# Altium schematic sheet main.SchDoc
size A4; SheetNumber: 1; SheetTotal: 14
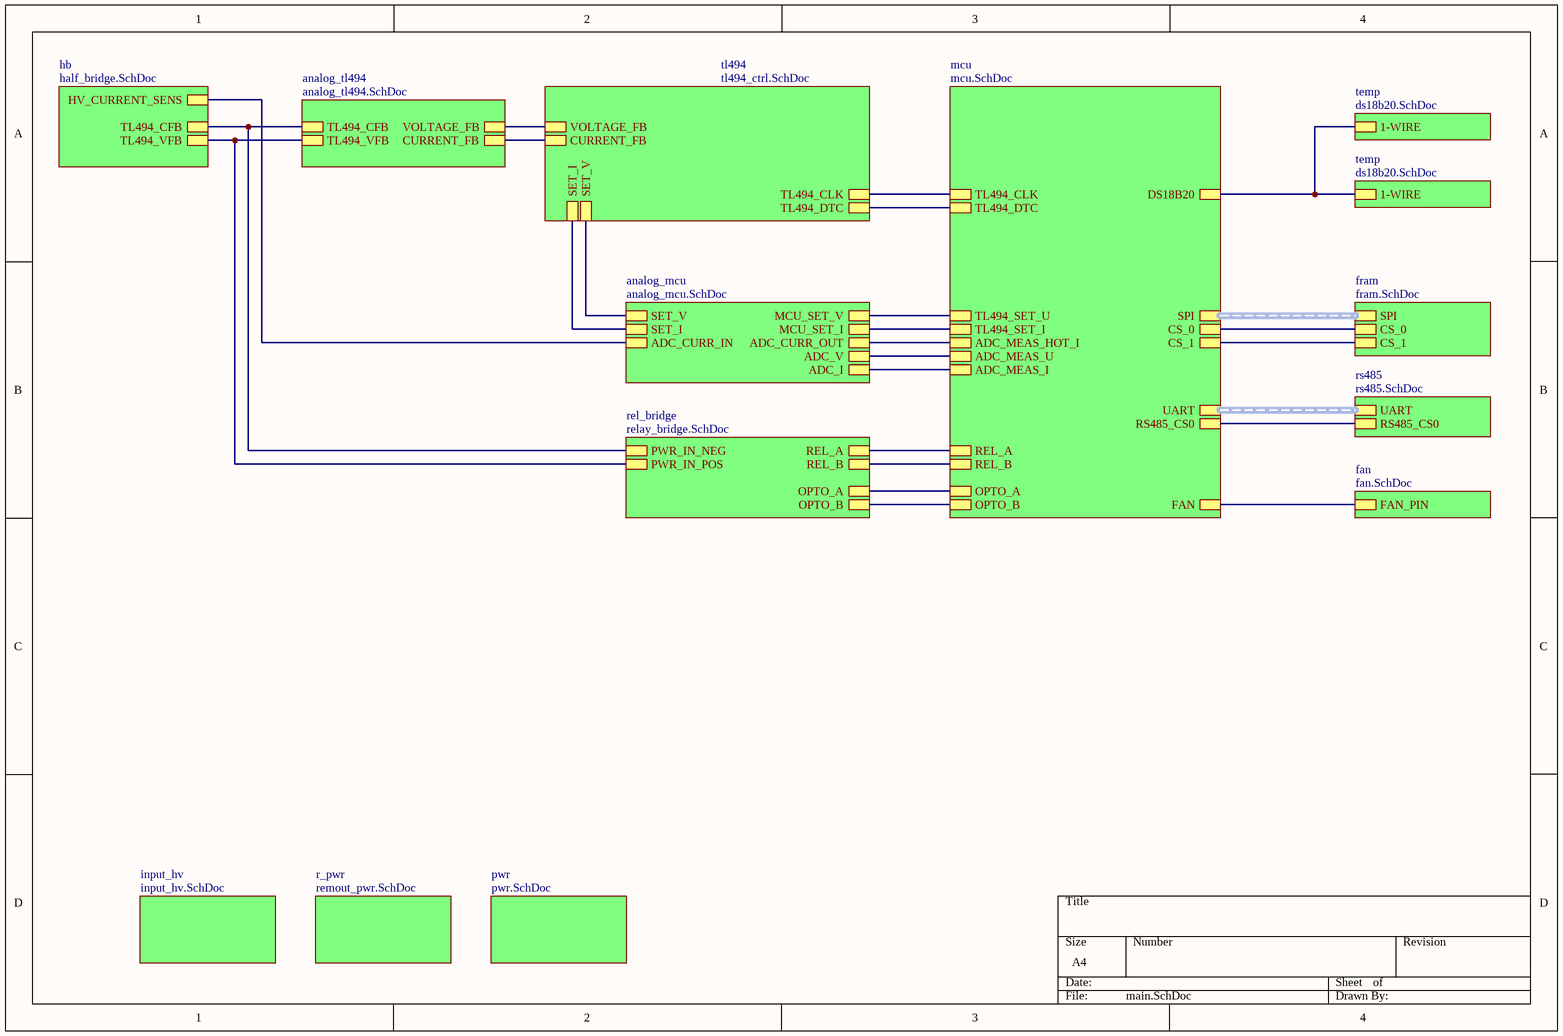
[diagram p0: main.SchDoc]

## Sub-sheets
analog_mcu = analog_mcu.SchDoc: MCU_SET_V, MCU_SET_I, SET_V, SET_I, ADC_I, ADC_V, ADC_CURR_OUT, ADC_CURR_IN
analog_tl494 = analog_tl494.SchDoc: TL494_CFB, CURRENT_FB, VOLTAGE_FB, TL494_VFB
fan = fan.SchDoc: FAN_PIN
fram = fram.SchDoc: SPI (harness SPI), CS_0, CS_1
hb = half_bridge.SchDoc: TL494_VFB, TL494_CFB, HV_CURRENT_SENS
input_hv = input_hv.SchDoc: no entries
mcu = mcu.SchDoc: CS_0, CS_1, REL_B, FAN, OPTO_B, TL494_SET_U, DS18B20, SPI (harness SPI), OPTO_A, TL494_CLK, TL494_DTC, ADC_MEAS_HOT_I, RS485_CS0, REL_A, TL494_SET_I, UART (harness UART), ADC_MEAS_U, ADC_MEAS_I
pwr = pwr.SchDoc: no entries
r_pwr = remout_pwr.SchDoc: no entries
rel_bridge = relay_bridge.SchDoc: PWR_IN_NEG, PWR_IN_POS, OPTO_A, OPTO_B, REL_A, REL_B
rs485 = rs485.SchDoc: UART (harness UART), RS485_CS0
temp = ds18b20.SchDoc: 1-WIRE
temp = ds18b20.SchDoc: 1-WIRE
tl494 = tl494_ctrl.SchDoc: VOLTAGE_FB, TL494_DTC, TL494_CLK, CURRENT_FB, SET_I, SET_V

## Nets
(unnamed): sheet mcu/CS_0, sheet fram/CS_0
(unnamed): sheet mcu/CS_1, sheet fram/CS_1
(unnamed): sheet mcu/REL_B, sheet rel_bridge/REL_B
(unnamed): sheet mcu/FAN, sheet fan/FAN_PIN
(unnamed): sheet mcu/OPTO_B, sheet rel_bridge/OPTO_B
(unnamed): sheet mcu/TL494_SET_U, sheet analog_mcu/MCU_SET_V
(unnamed): sheet mcu/DS18B20, sheet temp/1-WIRE, sheet temp/1-WIRE
(unnamed): sheet mcu/OPTO_A, sheet rel_bridge/OPTO_A
(unnamed): sheet mcu/TL494_CLK, sheet tl494/TL494_CLK
(unnamed): sheet mcu/TL494_DTC, sheet tl494/TL494_DTC
(unnamed): sheet mcu/ADC_MEAS_HOT_I, sheet analog_mcu/ADC_CURR_OUT
(unnamed): sheet mcu/RS485_CS0, sheet rs485/RS485_CS0
(unnamed): sheet mcu/REL_A, sheet rel_bridge/REL_A
(unnamed): sheet mcu/TL494_SET_I, sheet analog_mcu/MCU_SET_I
(unnamed): sheet mcu/ADC_MEAS_U, sheet analog_mcu/ADC_V
(unnamed): sheet mcu/ADC_MEAS_I, sheet analog_mcu/ADC_I
(unnamed): sheet hb/TL494_VFB, sheet rel_bridge/PWR_IN_POS, sheet analog_tl494/TL494_VFB
(unnamed): sheet hb/TL494_CFB, sheet rel_bridge/PWR_IN_NEG, sheet analog_tl494/TL494_CFB
(unnamed): sheet hb/HV_CURRENT_SENS, sheet analog_mcu/ADC_CURR_IN
(unnamed): sheet tl494/VOLTAGE_FB, sheet analog_tl494/VOLTAGE_FB
(unnamed): sheet tl494/CURRENT_FB, sheet analog_tl494/CURRENT_FB
(unnamed): sheet tl494/SET_I, sheet analog_mcu/SET_I
(unnamed): sheet tl494/SET_V, sheet analog_mcu/SET_V

## Buses and harness runs
harness sheet fram/SPI = sheet mcu/SPI
harness sheet mcu/UART = sheet rs485/UART